# Altium schematic sheet Sheet1.SchDoc
size A3; SheetNumber: 1; SheetTotal: 2
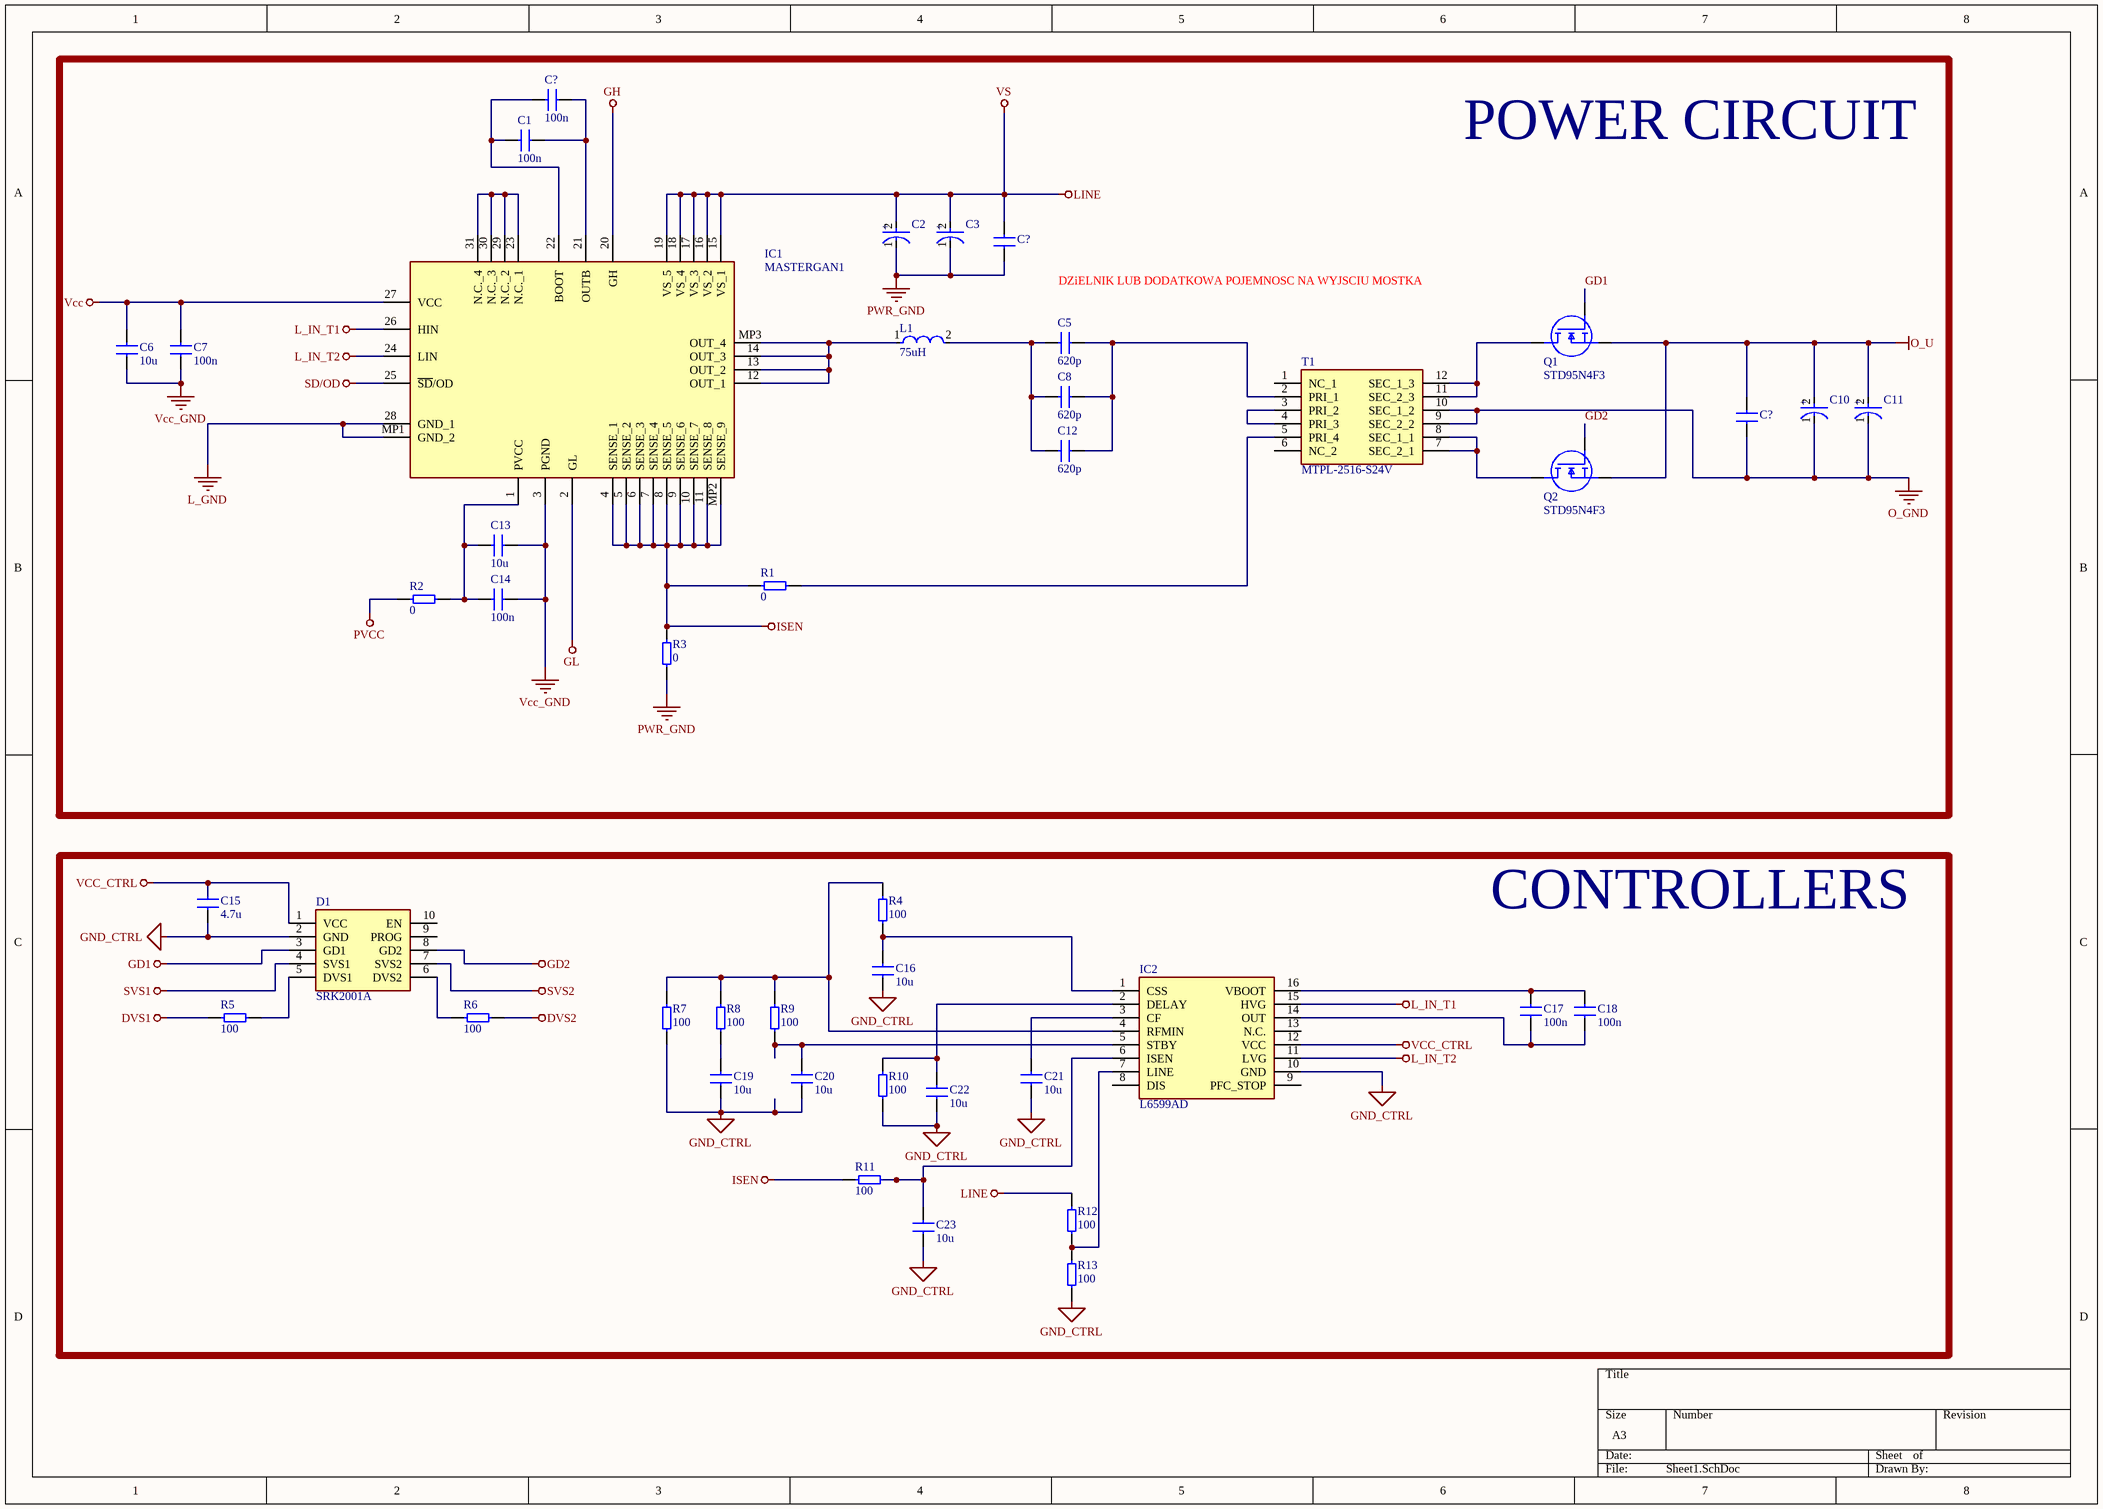
[diagram p0: Sheet1.SchDoc]

## Parts
(Parts that share a designator on the sheet are numbered #1, #2 ... from top to bottom, then left to right.)
C1  100n  [Capcitor_1206]
C2  450BXW100MEFR18X30  [FP-BXW18X30-MFG]  (value not drawn)
C3  450BXW100MEFR18X30  [FP-BXW18X30-MFG]  (value not drawn)
C5  620p  [Capcitor_1206]
C6  10u  [Capcitor_1206]
C7  100n  [Capcitor_1206]
C8  620p  [Capcitor_1206]
C10  450BXW100MEFR18X30  [FP-BXW18X30-MFG]  (value not drawn)
C11  450BXW100MEFR18X30  [FP-BXW18X30-MFG]  (value not drawn)
C12  620p  [Capcitor_1206]
C13  10u  [Capcitor_1206]
C14  100n  [Capcitor_1206]
C15  4.7u  [Capcitor_1206]
C16  10u  [Capcitor_1206]
C17  100n  [Capcitor_1206]
C18  100n  [Capcitor_1206]
C19  10u  [Capcitor_1206]
C20  10u  [Capcitor_1206]
C21  10u  [Capcitor_1206]
C22  10u  [Capcitor_1206]
C23  10u  [Capcitor_1206]
C?#1  620p  [Capcitor_1206]  (value not drawn)
C?#2  620p  [Capcitor_1206]  (value not drawn)
C?#3  100n  [Capcitor_1206]
D1  SRK2001A  [SOIC127P600X175-8N]
IC1  MASTERGAN1  [MASTERGAN1]
IC2  L6599AD  [SOIC127P600X175-16N]
L1  75uH  [FP-IHLP-4040ED-FP_3_175x4-MFG]
Q1  STD95N4F3  [STD95N4F3]
Q2  STD95N4F3  [STD95N4F3]
R1  0  [Resistor_1206]
R2  0  [Resistor_1206]
R3  0  [Resistor_1206]
R4  100  [Resistor_1206]
R5  100  [Resistor_1206]
R6  100  [Resistor_1206]
R7  100  [Resistor_1206]
R8  100  [Resistor_1206]
R9  100  [Resistor_1206]
R10  100  [Resistor_1206]
R11  100  [Resistor_1206]
R12  100  [Resistor_1206]
R13  100  [Resistor_1206]
T1  MTPL-2516-S24V  [MTPL2516S24V]

## Blocks framed on the sheet
POWER CIRCUIT: C1-C3 C5-C8 C10-C14 C?#1-C?#3 IC1 L1 Q1 Q2 R1-R3 T1
CONTROLLERS: C15-C23 D1 IC2 R4-R13

## Nets
DVS1: R5.1
DVS2: R6.2
GD1: D1.3(GD1) Q1.1(G)
GD2: D1.8(GD2) Q2.1(G)
GH: IC1.20(GH)
GL: IC1.2(GL)
GND_CTRL: C15.2 C16.1 C19.1 C20.1 C21.1 C22.1 C23.1 D1.2(GND) IC2.10(GND) R7.1 R10.1 R13.1
ISEN: IC1.4(SENSE_1) IC1.5(SENSE_2) IC1.6(SENSE_3) IC1.7(SENSE_4) IC1.8(SENSE_5) IC1.9(SENSE_6) IC1.10(SENSE_7) IC1.11(SENSE_8) IC1.MP2(SENSE_9) R1.1 R3.2 R11.1
L_GND: IC1.28(GND_1) IC1.MP1(GND_2)
L_IN_T1: IC1.26(HIN) IC2.15(HVG)
L_IN_T2: IC1.24(LIN) IC2.11(LVG)
LINE: C2.2(A) C3.2(A) C?#1.2 IC1.15(VS_1) IC1.16(VS_2) IC1.17(VS_3) IC1.18(VS_4) IC1.19(VS_5) R12.2  [also labelled VS]
O_GND: C10.1(C) C11.1(C) C?#2.1 T1.9(SEC_2_2) T1.10(SEC_1_2)
O_U: C10.2(A) C11.2(A) C?#2.2 Q1.3(S) Q2.3(S)
PVCC: R2.1
PWR_GND: C2.1(C) C3.1(C) C?#1.1 R3.1
SD/OD: IC1.25(~{SD}/OD)
SVS1: D1.4(SVS1)
SVS2: D1.7(SVS2)
Vcc: C6.1 C7.1 IC1.27(VCC)
VCC_CTRL: C15.1 D1.1(VCC) IC2.12(VCC)
Vcc_GND: C6.2 C7.2 C13.2 C14.2 IC1.3(PGND)
NetC1_1: C1.1 C?#3.1 IC1.22(BOOT)
NetC1_2: C1.2 C?#3.2 IC1.21(OUTB)
NetC5_1: C5.1 C8.1 C12.1 L1.2
NetC5_2: C5.2 C8.2 C12.2 T1.2(PRI_1)
NetC13_1: C13.1 C14.1 IC1.1(PVCC) R2.2
NetC16_2: C16.2 IC2.1(CSS) R4.1
NetC17_1: C17.1 C18.1 IC2.14(OUT)
NetC17_2: C17.2 C18.2 IC2.16(VBOOT)
NetC19_2: C19.2 R8.1
NetC20_2: C20.2 IC2.5(STBY) R9.1
NetC21_2: C21.2 IC2.3(CF)
NetC22_2: C22.2 IC2.2(DELAY) R10.2
NetC23_2: C23.2 IC2.6(ISEN) R11.2
NetD1_5: D1.5(DVS1) R5.2
NetD1_6: D1.6(DVS2) R6.1
NetIC1_12: IC1.12(OUT_1) IC1.13(OUT_2) IC1.14(OUT_3) IC1.MP3(OUT_4) L1.1
NetIC1_23: IC1.23(N.C._1) IC1.29(N.C._2) IC1.30(N.C._3) IC1.31(N.C._4)
NetIC2_4: IC2.4(RFMIN) R4.2 R7.2 R8.2 R9.2
NetIC2_7: IC2.7(LINE) R12.1 R13.2
NetQ1_4: Q1.4(D) T1.11(SEC_2_3) T1.12(SEC_1_3)
NetQ2_4: Q2.4(D) T1.7(SEC_2_1) T1.8(SEC_1_1)
NetR1_2: R1.2 T1.5(PRI_4)
NetT1_3: T1.3(PRI_2) T1.4(PRI_3)

Not connected (* = marked no-connect by the designer): D1 9(PROG) 10(EN); IC2 8(DIS) 9(PFC_STOP) 13(N.C.); T1 1(NC_1) 6(NC_2)

## Notes on the sheet
- DZiELNIK LUB DODATKOWA POJEMNOSC NA WYJSCIU MOSTKA
- (in symbol CMP-35376-000021-1) +

## Library data of the parts
C1 C5-C8 C12-C23 C?#1-C?#3 = Capacitor_1206: Capacitor - Standard SMD; Voltage: 35 V; MPN: *
  C1 C7 C14 C17 C18 C?#3: Capacitance: 100n
  C5 C8 C12 C?#1 C?#2: Capacitance: 620p
  C6 C13 C16 C19-C23: Capacitance: 10u
  C15: Capacitance: 4.7u
C2 C3 C10 C11 = CMP-35376-000021-1: CAP ALUM 100UF 20% 450V RADIAL; Polarity: Polar; Life (Hours): 12000Hour; Ripple Current: 750mA; Case/Package: Radial; Capacitance: 100uF; Lead Pitch: 0.295inch; Packaging: Bulk; Mount: Through Hole; Tolerance: 20%; Height - Seated (Max): 1.26inch; Max Operating Temperature: 105°C; Min Operating Temperature: -40°C; Voltage Rating: 450V
D1 = SRK2001A: Diode; Manufacturer_Name: STMicroelectronics; Datasheet Link: https://componentsearchengine.com/Datasheets/1/SRK2001A.pdf; Height: 1.75mm; Manufacturer_Part_Number: SRK2001A; Mouser Part Number: 511-SRK2001A; Mouser Price/Stock: https://www.mouser.co.uk/ProductDetail/STMicroelectronics/SRK2001A?qs=aVyJF2WnouTzNJDK1aOmdg%3D%3D; Arrow Part Number: SRK2001A; Arrow Price/Stock: https://www.arrow.com/en/products/srk2001a/stmicroelectronics
IC1 = MASTERGAN1: Integrated Circuit; Manufacturer_Name: STMicroelectronics; Datasheet Link: https://www.mouser.com/datasheet/2/389/mastergan1-1893186.pdf; Height: 1mm; Manufacturer_Part_Number: MASTERGAN1; Mouser Part Number: 511-MASTERGAN1; Mouser Price/Stock: https://www.mouser.co.uk/ProductDetail/STMicroelectronics/MASTERGAN1?qs=hWgE7mdIu5TUQlvSzk235A%3D%3D; Arrow Part Number: MASTERGAN1; Arrow Price/Stock: https://www.arrow.com/en/products/mastergan1/stmicroelectronics?region=nac
IC2 = L6599AD: Integrated Circuit; Manufacturer_Name: STMicroelectronics; Datasheet Link: https://www.st.com/resource/en/datasheet/l6599a.pdf; Height: 1.75mm; Manufacturer_Part_Number: L6599AD; Mouser Part Number: 511-L6599AD; Mouser Price/Stock: https://www.mouser.co.uk/ProductDetail/STMicroelectronics/L6599AD?qs=7o0qgsFWxcZfFVshD8Fr5g%3D%3D; Arrow Part Number: L6599AD; Arrow Price/Stock: https://www.arrow.com/en/products/l6599ad/stmicroelectronics?region=nac
L1 = CMP-02424-000499-1: Automotive Inductors, High Temperature (155 °C) Series 47uH 3.6A 127.87mΩ 20%
Q1 Q2 = STD95N4F3: MOSFET (N-Channel); Manufacturer_Name: STMicroelectronics; Datasheet Link: https://www.st.com/resource/en/datasheet/std95n4f3.pdf; Height: 2.4mm; Manufacturer_Part_Number: STD95N4F3; Mouser Part Number: 511-STD95N4F3; Mouser Price/Stock: https://www.mouser.co.uk/ProductDetail/STMicroelectronics/STD95N4F3?qs=Djavi1aLnwoepdJqDxyf1g%3D%3D; Arrow Part Number: STD95N4F3; Arrow Price/Stock: https://www.arrow.com/en/products/std95n4f3/stmicroelectronics
R1-R13 = Resistor_1206: Resistor - Standard SMD; Power rate: *; MPN: *
  R1-R3: Resistance: 0
  R4-R13: Resistance: 100
T1 = MTPL-2516-S24V: Transformer; Manufacturer_Name: Vishay; Datasheet Link: https://componentsearchengine.com/Datasheets/2/MTPL-2516-S24V.pdf; Height: 16.51mm; Manufacturer_Part_Number: MTPL-2516-S24V; Mouser Part Number: 70-MTPL-2516-S24V; Mouser Price/Stock: https://www.mouser.co.uk/ProductDetail/Vishay-Dale/MTPL-2516-S24V?qs=wd5RIQLrsJgVmtJW6evrjA%3D%3D